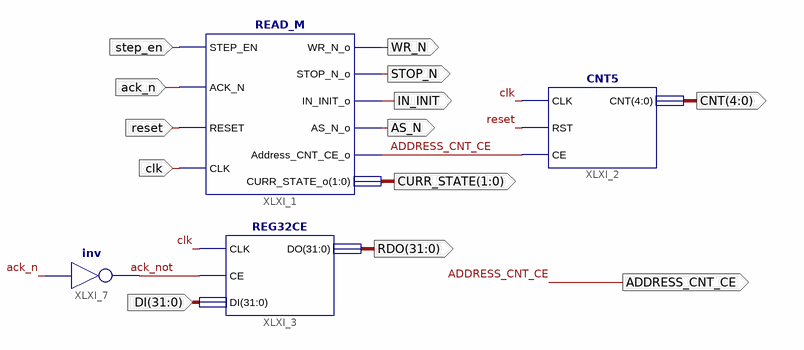
[diagram p0: schematic sheet 1]
// Xilinx ISE schematic readmachinem.sch (spartan6) as structural Verilog: 4 symbols, 13 ports
module readmachinem (
  input  step_en,
  input  ack_n,
  input  reset,
  input  clk,
  input  [31:0] DI,
  output WR_N,
  output STOP_N,
  output IN_INIT,
  output AS_N,
  output [1:0] CURR_STATE,
  output ADDRESS_CNT_CE,
  output [4:0] CNT,
  output [31:0] RDO
);

  wire ack_not;

  READ_M XLXI_1 (
    .STEP_EN(step_en), .ACK_N(ack_n), .RESET(reset), .CLK(clk), .WR_N_o(WR_N), .STOP_N_o(STOP_N),
    .IN_INIT_o(IN_INIT), .AS_N_o(AS_N), .Address_CNT_CE_o(ADDRESS_CNT_CE), .CURR_STATE_o(CURR_STATE));
  CNT5 XLXI_2 (.CLK(clk), .RST(reset), .CE(ADDRESS_CNT_CE), .CNT(CNT));
  REG32CE XLXI_3 (.CLK(clk), .CE(ack_not), .DI(DI), .DO(RDO));
  not XLXI_7 (ack_not, ack_n);
endmodule
